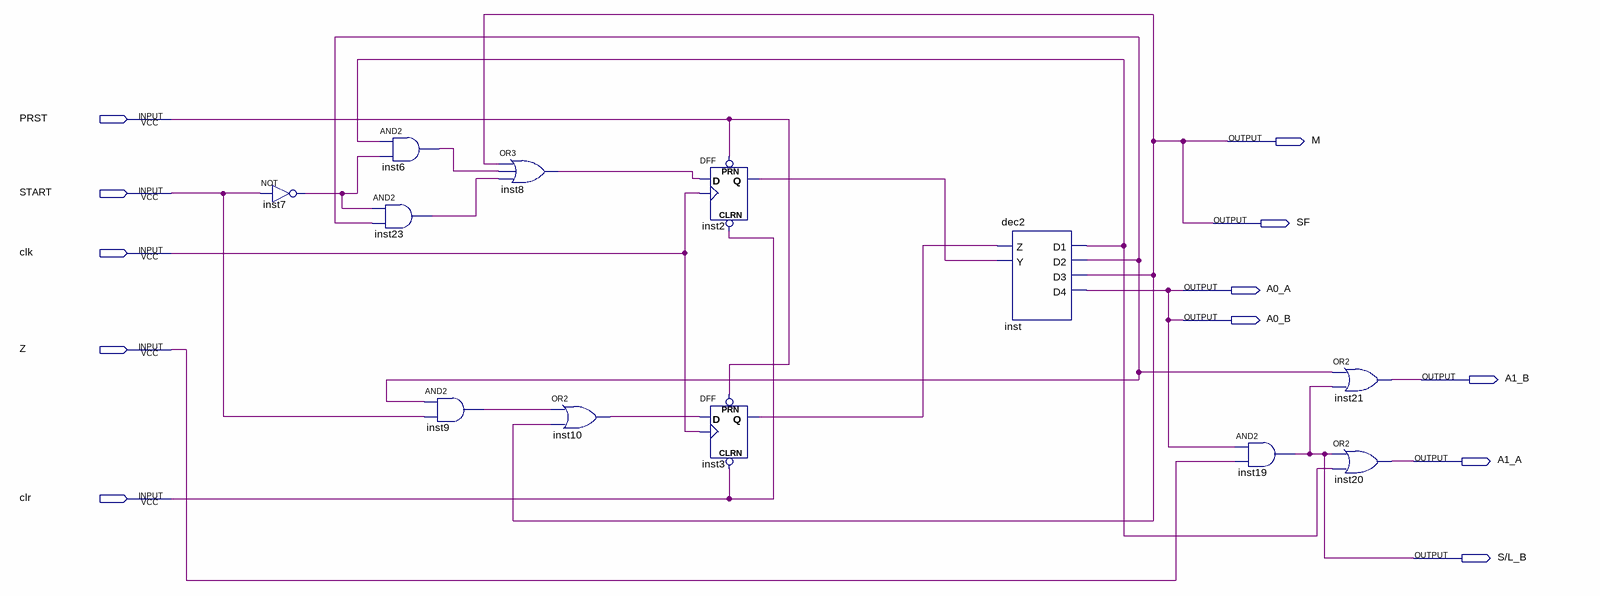
[diagram p0: schematic sheet]
// Quartus schematic Controller.bdf as structural Verilog: 12 symbols, 12 pins
module Controller (
  input  PRST,
  input  START,
  input  clk,
  input  Z,
  input  clr,
  output M,
  output SF,
  output A0_A,
  output A0_B,
  output A1_B,
  output A1_A,
  output \S/L_B 
);

  wire inst2_q, inst3_q, inst6_out, inst7_out, inst8_out, inst9_out, inst10_out, inst23_out, inst_d1, inst_d2;

  not inst7 (inst7_out, START);
  and inst6 (inst6_out, inst_d1, inst7_out);
  and inst23 (inst23_out, inst7_out, inst_d2);
  and inst9 (inst9_out, inst_d2, START);
  or inst8 (inst8_out, M, inst6_out, inst23_out);
  or inst10 (inst10_out, inst9_out, M);
  DFF inst2 (.CLRN(clr), .CLK(clk), .D(inst8_out), .PRN(PRST), .Q(inst2_q));
  DFF inst3 (.CLRN(clr), .CLK(clk), .D(inst10_out), .PRN(PRST), .Q(inst3_q));
  dec2 inst (.Z(inst3_q), .Y(inst2_q), .D1(inst_d1), .D2(inst_d2), .D3(M), .D4(A0_A));
  and inst19 (\S/L_B , A0_A, Z);
  or inst21 (A1_B, inst_d2, \S/L_B );
  or inst20 (A1_A, \S/L_B , inst_d1);

  assign A0_B = A0_A;
  assign SF = M;
endmodule
